# EAGLE design RespirationSchematics (EAGLE 9.6.2)
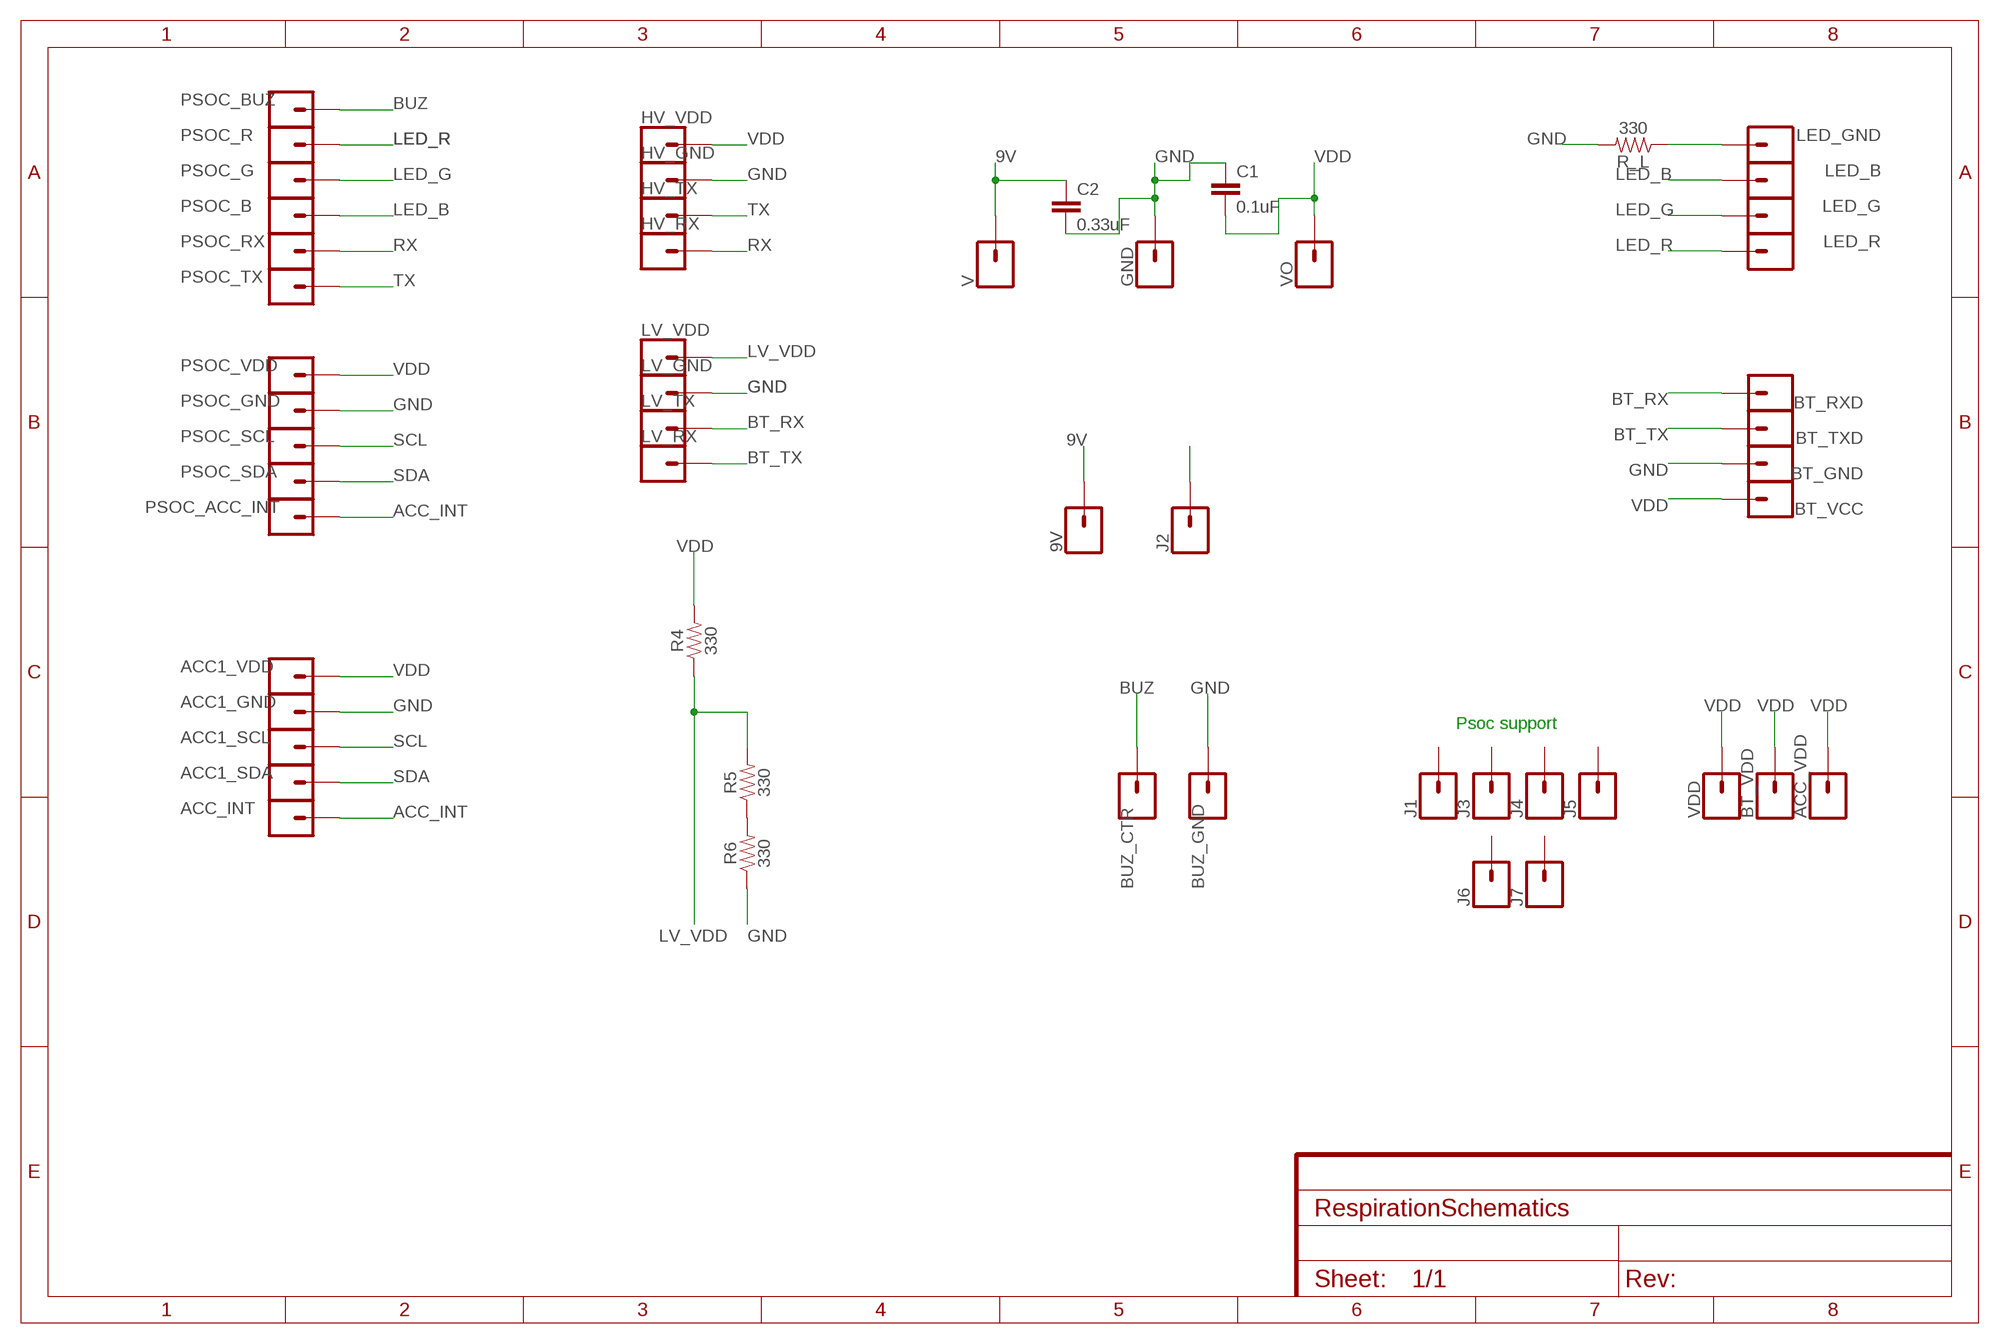
[diagram p0: schematic, sheet 1]

## Parts
9V  CONN_01  [1X01]
ACC1_GND  CONN_01  [1X01]
ACC1_SCL  CONN_01  [1X01]
ACC1_SDA  CONN_01  [1X01]
ACC1_VDD  CONN_01  [1X01]
ACC_INT  CONN_01  [1X01]
ACC_VDD  CONN_01  [1X01]
BT_GND  CONN_01  [1X01]
BT_RXD  CONN_01  [1X01]
BT_TXD  CONN_01  [1X01]
BT_VCC  CONN_01  [1X01]
BT_VDD  CONN_01  [1X01]
BUZ_CTR  CONN_01  [1X01]
BUZ_GND  CONN_01  [1X01]
C1  0.1uF  0.1UF-KIT-EZ-50V-20%  [CAP-PTH-SMALL-KIT]
C2  0.33uF  0.1UF-KIT-EZ-50V-20%  [CAP-PTH-SMALL-KIT]
GND  CONN_01  [1X01]
HV_GND  CONN_01  [1X01]
HV_RX  CONN_01  [1X01]
HV_TX  CONN_01  [1X01]
HV_VDD  CONN_01  [1X01]
J1  CONN_01  [1X01]
J2  CONN_01  [1X01]
J3  CONN_01  [1X01]
J4  CONN_01  [1X01]
J5  CONN_01  [1X01]
J6  CONN_01  [1X01]
J7  CONN_01  [1X01]
LED_B  CONN_01  [1X01]
LED_G  CONN_01  [1X01]
LED_GND  CONN_01  [1X01]
LED_R  CONN_01  [1X01]
LV_GND  CONN_01  [1X01]
LV_RX  CONN_01  [1X01]
LV_TX  CONN_01  [1X01]
LV_VDD  CONN_01  [1X01]
PSOC_ACC_INT  CONN_01  [1X01]
PSOC_B  CONN_01  [1X01]
PSOC_BUZ  CONN_01  [1X01]
PSOC_G  CONN_01  [1X01]
PSOC_GND  CONN_01  [1X01]
PSOC_R  CONN_01  [1X01]
PSOC_RX  CONN_01  [1X01]
PSOC_SCL  CONN_01  [1X01]
PSOC_SDA  CONN_01  [1X01]
PSOC_TX  CONN_01  [1X01]
PSOC_VDD  CONN_01  [1X01]
R4  330  330OHM-HORIZ-1/10W-5%  [AXIAL-0.3]
R5  330  330OHM-HORIZ-1/10W-5%  [AXIAL-0.3]
R6  330  330OHM-HORIZ-1/10W-5%  [AXIAL-0.3]
R_L  330  330OHM-HORIZ-1/10W-5%  [AXIAL-0.3]
V  CONN_01  [1X01]
VDD  CONN_01  [1X01]
VO  CONN_01  [1X01]

## Nets
9V: 9V.1 C2.1 V.1
ACC_INT: ACC_INT.1 PSOC_ACC_INT.1
BT_RX: BT_RXD.1 LV_TX.1
BT_TX: BT_TXD.1 LV_RX.1
BUZ: BUZ_CTR.1 PSOC_BUZ.1
GND: ACC1_GND.1 BT_GND.1 BUZ_GND.1 C1.1 C2.2 GND.1 HV_GND.1 J2.1 LV_GND.1 PSOC_GND.1 R6.P$1 R_L.P$2
LED_B: LED_B.1 PSOC_B.1
LED_G: LED_G.1 PSOC_G.1
LED_R: LED_R.1 PSOC_R.1
LV_VDD: LV_VDD.1 R4.P$1 R5.P$2
N$1: LED_GND.1 R_L.P$1
N$4: R5.P$1 R6.P$2
RX: HV_RX.1 PSOC_RX.1
SCL: ACC1_SCL.1 PSOC_SCL.1
SDA: ACC1_SDA.1 PSOC_SDA.1
TX: HV_TX.1 PSOC_TX.1
VDD: ACC1_VDD.1 ACC_VDD.1 BT_VCC.1 BT_VDD.1 C1.2 HV_VDD.1 PSOC_VDD.1 R4.P$2 VDD.1 VO.1
Unconnected: J1.1 J3.1 J4.1 J5.1 J6.1 J7.1

## Notes on the sheet
- Psoc support

## Library data of the parts
9V ACC1_GND ACC1_SCL ACC1_SDA ACC1_VDD ACC_INT ACC_VDD BT_GND BT_RXD BT_TXD BT_VCC BT_VDD BUZ_CTR BUZ_GND GND HV_GND HV_RX HV_TX HV_VDD J1-J7 LED_B LED_G LED_GND LED_R LV_GND LV_RX LV_TX LV_VDD PSOC_ACC_INT PSOC_B PSOC_BUZ PSOC_G PSOC_GND PSOC_R PSOC_RX PSOC_SCL PSOC_SDA PSOC_TX PSOC_VDD V VDD VO = SparkFun-Connectors:CONN_01: Single connection point. Often used as Generic Header-pin footprint for 0.1 inch spaced/style header connections On any of the 0.1 inch spaced packages, you can populate with these: Break Away Headers - Straight <https://www.sparkfun.com/products/116> (PRT-00116) Break Away Male Headers - Right Angle <https://www.sparkfun.com/products/553> (PRT-00553) Female Headers <https://www.sparkfun.com/products/115> (PRT-00115) Break Away Headers - Machine Pin <https://www.sparkfun.com/products/117> (PRT-00117) Break Away Female Headers - Swiss Machine Pin <https://www.sparkfun.com/products/743> (PRT-00743) This device is also useful as a general connection point to wire up your design to another part of your project. Our various solder wires solder well into these plated through hole pads. Hook-Up Wire - Assortment (Stranded, 22 AWG) <https://www.sparkfun.com/products/11375> (PRT-11375) Hook-Up Wire - Assortment (Solid Core, 22 AWG) <https://www.sparkfun.com/products/11367> (PRT-11367) View the entire wire category on our website here <https://www.sparkfun.com/categories/141> Special notes: SMTSO-256-ET is a "flush mount" nut for a 4-40 screw. We mostly use this on specialty testbeds; it is a nice way to connect hardware to your PCB at an adjustable hieght. Also note, the SNAP packages are for using a snappable style connector. We sell a baggie of snaps and they are also used on two LilyPad designs: Snap Assortment - 30 pack (male and female) <https://www.sparkfun.com/products/11347> (DEV-11347) LilyPad Arduino SimpleSnap <https://www.sparkfun.com/products/10941> (DEV-10941) LilyPad SimpleSnap Protoboard <https://www.sparkfun.com/products/10940> (DEV-10940)
C1 = SparkFun-Capacitors:0.1UF: 0.1µF ceramic capacitors A capacitor is a passive two-terminal electrical component used to store electrical energy temporarily in an electric field.; PROD_ID: CAP-08370
C2 = SparkFun-Capacitors:0.1UF: 0.1µF ceramic capacitors A capacitor is a passive two-terminal electrical component used to store electrical energy temporarily in an electric field.; PROD_ID: CAP-08370; VALUE: 0.1uF
R4-R6 R_L = SparkFun-Resistors:330OHM: 330Ω resistor A resistor is a passive two-terminal electrical component that implements electrical resistance as a circuit element. Resistors act to reduce current flow, and, at the same time, act to lower voltage levels within circuits. - Wikipedia; PROD_ID: RES-8371

## Board
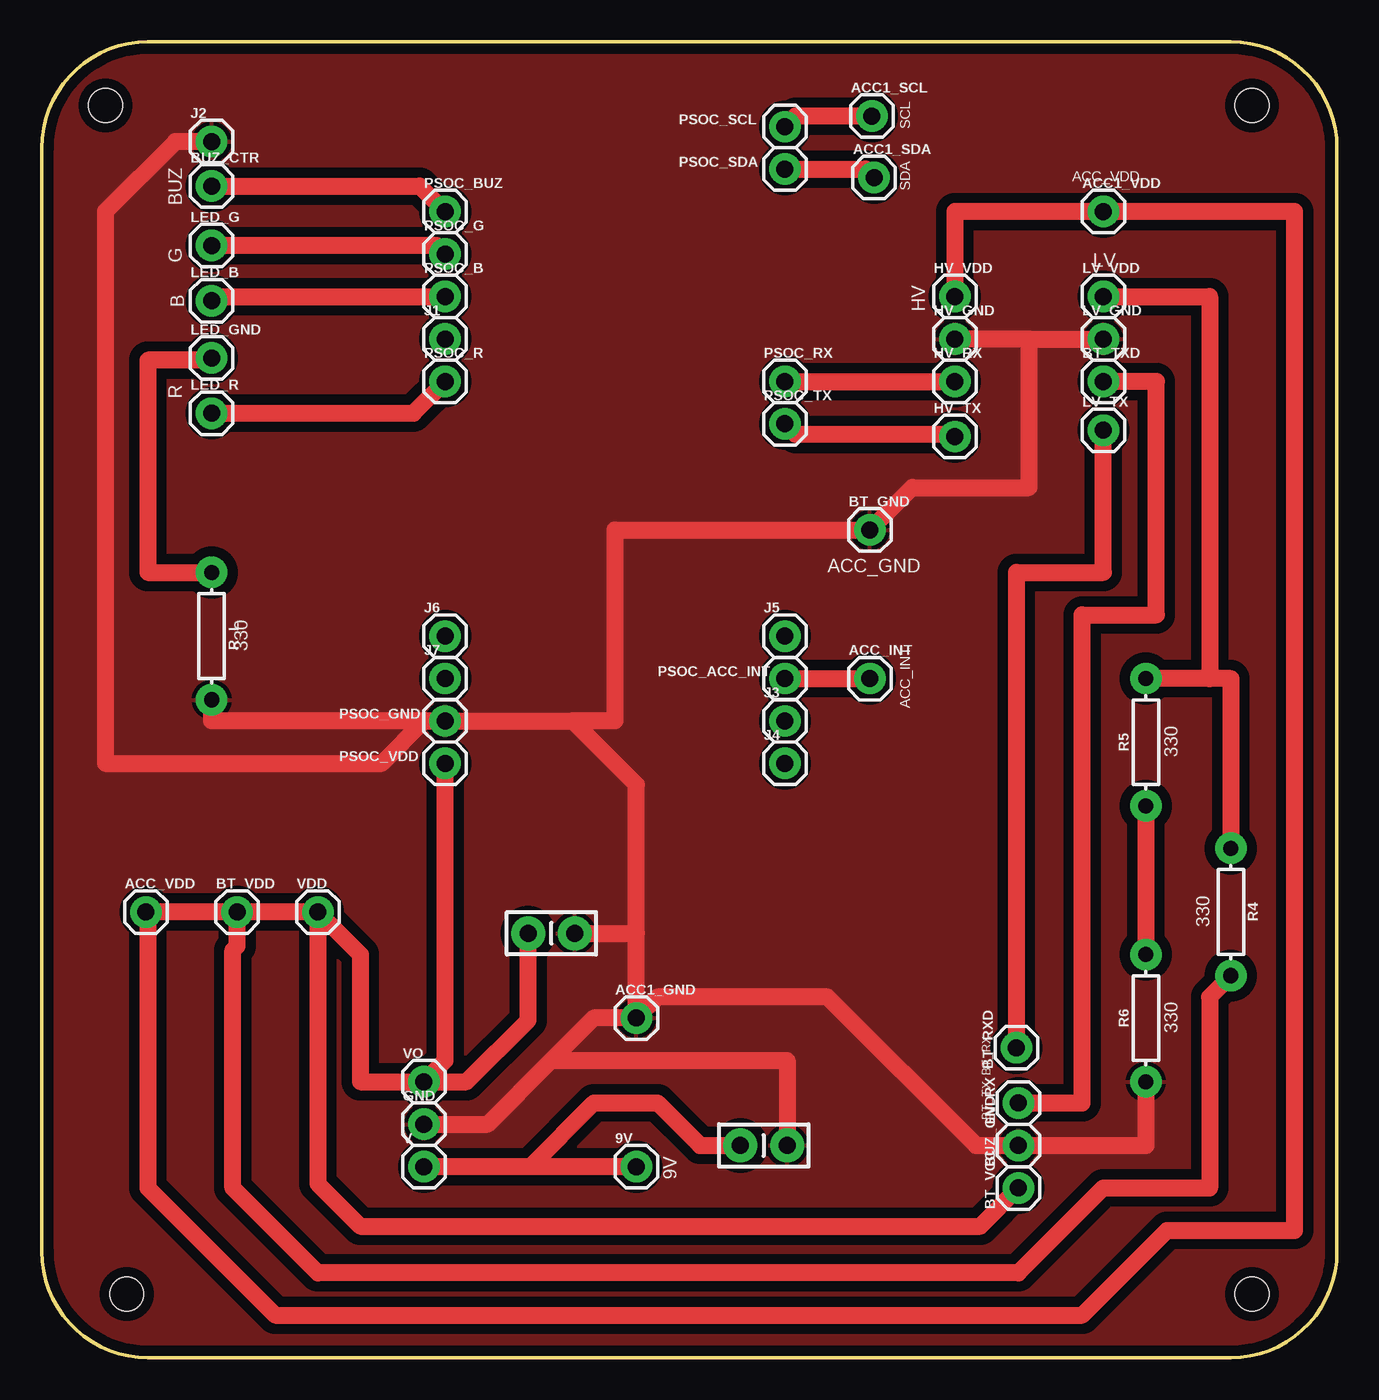
[diagram p1: board, top side]

Size 77.47 x 78.74 mm. Coordinates in mm from the lower left corner, seen from the top.
Outline: 77.47,72.39 77.47,6.35 arc-90 71.12,0 6.35,0 arc-90 0,6.35 0,72.39 arc-90 6.35,78.74 71.12,78.74 arc-90 77.47,72.39
Copper layers (1*16): Top 0.035mm / dielectric 1.5mm / Bottom 0.035mm
Design rules "sparkfun": minimum track width 8mil, minimum drill 20mil, track to track 8mil, track to pad 8mil, pad to pad 8mil, via to via 8mil, smd to smd 8mil, copper to edge 8mil, drill to drill 8mil, minimum pad ring 12mil, minimum via ring 10mil, stop-mask expansion 4mil, vias tented up to drill 20mil, thermal gap 10mil
Holes 2 mm at 3.81,74.93 5.08,3.81 72.39,3.81 72.39,74.93

### Footprints (pad centres in the part's own frame; a part is rotated, then mirrored left to right if it is on the bottom)
1X01 = drill 1.016 pad 1.88: 1 0,0
CAP-PTH-SMALL-KIT = drill 1.016 pad 2.032: 1 -1.397,0; 2 1.397,0
AXIAL-0.3 = drill 0.9 pad 1.88: P$1 -3.81,0; P$2 3.81,0

### Placement (x,y rotation side)
9V  35.56,11.43 0 top
ACC1_GND  35.56,20.32 0 top
ACC1_SCL  49.66,74.3 0 top
ACC1_SDA  49.78,70.61 0 top
ACC1_VDD  63.5,68.58 0 top
ACC_INT  49.53,40.64 0 top
ACC_VDD  6.22,26.67 0 top
BT_GND  49.53,49.53 0 top
BT_RXD  58.29,18.54 90 top
BT_TXD  63.5,58.42 0 top
BT_VCC  58.42,10.16 90 top
BT_VDD  11.68,26.67 0 top
BUZ_CTR  10.16,70.1 0 top
BUZ_GND  58.42,12.7 90 top
C1  30.48,25.4 180 top
C2  43.18,12.7 0 top
GND  22.86,13.97 0 top
HV_GND  54.61,60.96 0 top
HV_RX  54.61,58.42 0 top
HV_TX  54.61,55.12 0 top
HV_VDD  54.61,63.5 0 top
J1  24.13,60.96 0 top
J2  10.16,72.77 0 top
J3  44.45,38.1 0 top
J4  44.45,35.56 0 top
J5  44.45,43.18 0 top
J6  24.13,43.18 0 top
J7  24.13,40.64 0 top
LED_B  10.16,63.25 0 top
LED_G  10.16,66.55 0 top
LED_GND  10.16,59.82 0 top
LED_R  10.16,56.52 0 top
LV_GND  63.5,60.96 0 top
LV_RX  58.42,15.24 90 top
LV_TX  63.5,55.5 0 top
LV_VDD  63.5,63.5 0 top
PSOC_ACC_INT  44.45,40.64 0 top
PSOC_B  24.13,63.5 0 top
PSOC_BUZ  24.13,68.58 0 top
PSOC_G  24.13,66.04 0 top
PSOC_GND  24.13,38.1 0 top
PSOC_R  24.13,58.42 0 top
PSOC_RX  44.45,58.42 0 top
PSOC_SCL  44.45,73.66 0 top
PSOC_SDA  44.45,71.12 0 top
PSOC_TX  44.45,55.88 0 top
PSOC_VDD  24.13,35.56 0 top
R4  71.12,26.67 270 top
R5  66.04,36.83 90 top
R6  66.04,20.32 90 top
R_L  10.16,43.18 270 top
V  22.86,11.43 0 top
VDD  16.51,26.67 0 top
VO  22.86,16.51 0 top

### Tracks (layer width: path | path; a pad name or v marks a point on that pad's centre or on a via)
9V
  Top 1.016: 9V.1 29.21,11.43 | 29.21,11.43 33.02,15.24 36.83,15.24 39.37,12.7 C2.1 | 29.21,11.43 V.1
ACC_INT
  Top 1.016: PSOC_ACC_INT.1 ACC_INT.1
BT_RX
  Top 1.016: BT_RXD.1 58.29,46.99 63.5,46.99 LV_TX.1
BT_TX
  Top 1.016: LV_RX.1 62.23,15.24 62.23,44.45 66.67,44.45 66.67,58.42 BT_TXD.1
BUZ
  Top 1.016: BUZ_CTR.1 22.61,70.1 PSOC_BUZ.1
GND
  Top 1.016: ACC1_GND.1 33.02,20.32 30.48,17.78 | 30.48,17.78 26.67,13.97 GND.1 | ACC1_GND.1 35.56,25.4 | 35.56,25.4 35.56,34.29 31.75,38.1 | 31.75,38.1 34.29,38.1 34.29,49.53 BT_GND.1 52.07,52.07 59.05,52.07 59.05,60.96 | PSOC_GND.1 10.16,38.1 R_L.P$2 | J2.1 8,72.77 3.81,68.58 3.81,35.56 20.32,35.56 22.86,38.1 PSOC_GND.1 | R6.P$1 66.04,12.7 BUZ_GND.1 55.88,12.7 46.99,21.59 36.83,21.59 ACC1_GND.1 | 59.05,60.96 LV_GND.1 | 59.05,60.96 HV_GND.1 | PSOC_GND.1 31.75,38.1 | C2.2 44.58,17.78 30.48,17.78 | 31.75,25.27 C1.1 35.56,25.4
  pour Top (isolate 0.61): 71.12,0 6.35,0 arc-90 0,6.35 0,72.39 arc-90 6.35,78.74 71.12,78.74 arc-90 77.47,72.39 77.47,6.35 arc-90
LED_B
  Top 1.016: LED_B.1 10.41,63.5 PSOC_B.1
LED_G
  Top 1.016: PSOC_G.1 23.62,66.55 LED_G.1
LED_R
  Top 1.016: LED_R.1 22.23,56.52 PSOC_R.1
LV_VDD
  Top 1.016: 69.85,40.64 R5.P$2 | R4.P$1 71.12,40.64 69.85,40.64 | LV_VDD.1 69.85,63.5 69.85,40.64
N$1
  Top 1.016: LED_GND.1 10.03,59.69 6.35,59.69 6.35,46.99 R_L.P$1
N$4
  Top 1.016: R5.P$1 R6.P$2
RX
  Top 1.016: PSOC_RX.1 HV_RX.1
SCL
  Top 1.016: PSOC_SCL.1 45.09,74.3 ACC1_SCL.1
SDA
  Top 1.016: PSOC_SDA.1 49.28,71.12 ACC1_SDA.1
TX
  Top 1.016: PSOC_TX.1 45.09,55.24 54.48,55.24 HV_TX.1
VDD
  Top 1.016: PSOC_VDD.1 24.13,17.78 VO.1 | R4.P$2 69.85,21.59 69.85,10.16 63.5,10.16 58.42,5.08 16.51,5.08 11.43,10.16 11.43,24.38 11.68,24.64 BT_VDD.1 | HV_VDD.1 54.61,68.58 ACC1_VDD.1 74.93,68.58 74.93,7.62 67.31,7.62 62.23,2.54 13.97,2.54 6.35,10.16 6.35,26.54 ACC_VDD.1 BT_VDD.1 | BT_VCC.1 56.13,7.87 19.05,7.87 16.51,10.41 VDD.1 | VDD.1 19.05,24.13 19.05,16.51 VO.1 | VDD.1 BT_VDD.1 | VO.1 25.4,16.51 29.08,20.19 C1.2

### Text on the board
tPlace: SCL | ACC_VDD | SDA | BUZ | G | LV | B | HV | R | ACC_GND | 330 | ACC_INT | 330 | 330 | 330 | BT_RX | BT_TX | 9V